# EAGLE design OledAdapter (EAGLE 7.5.0)
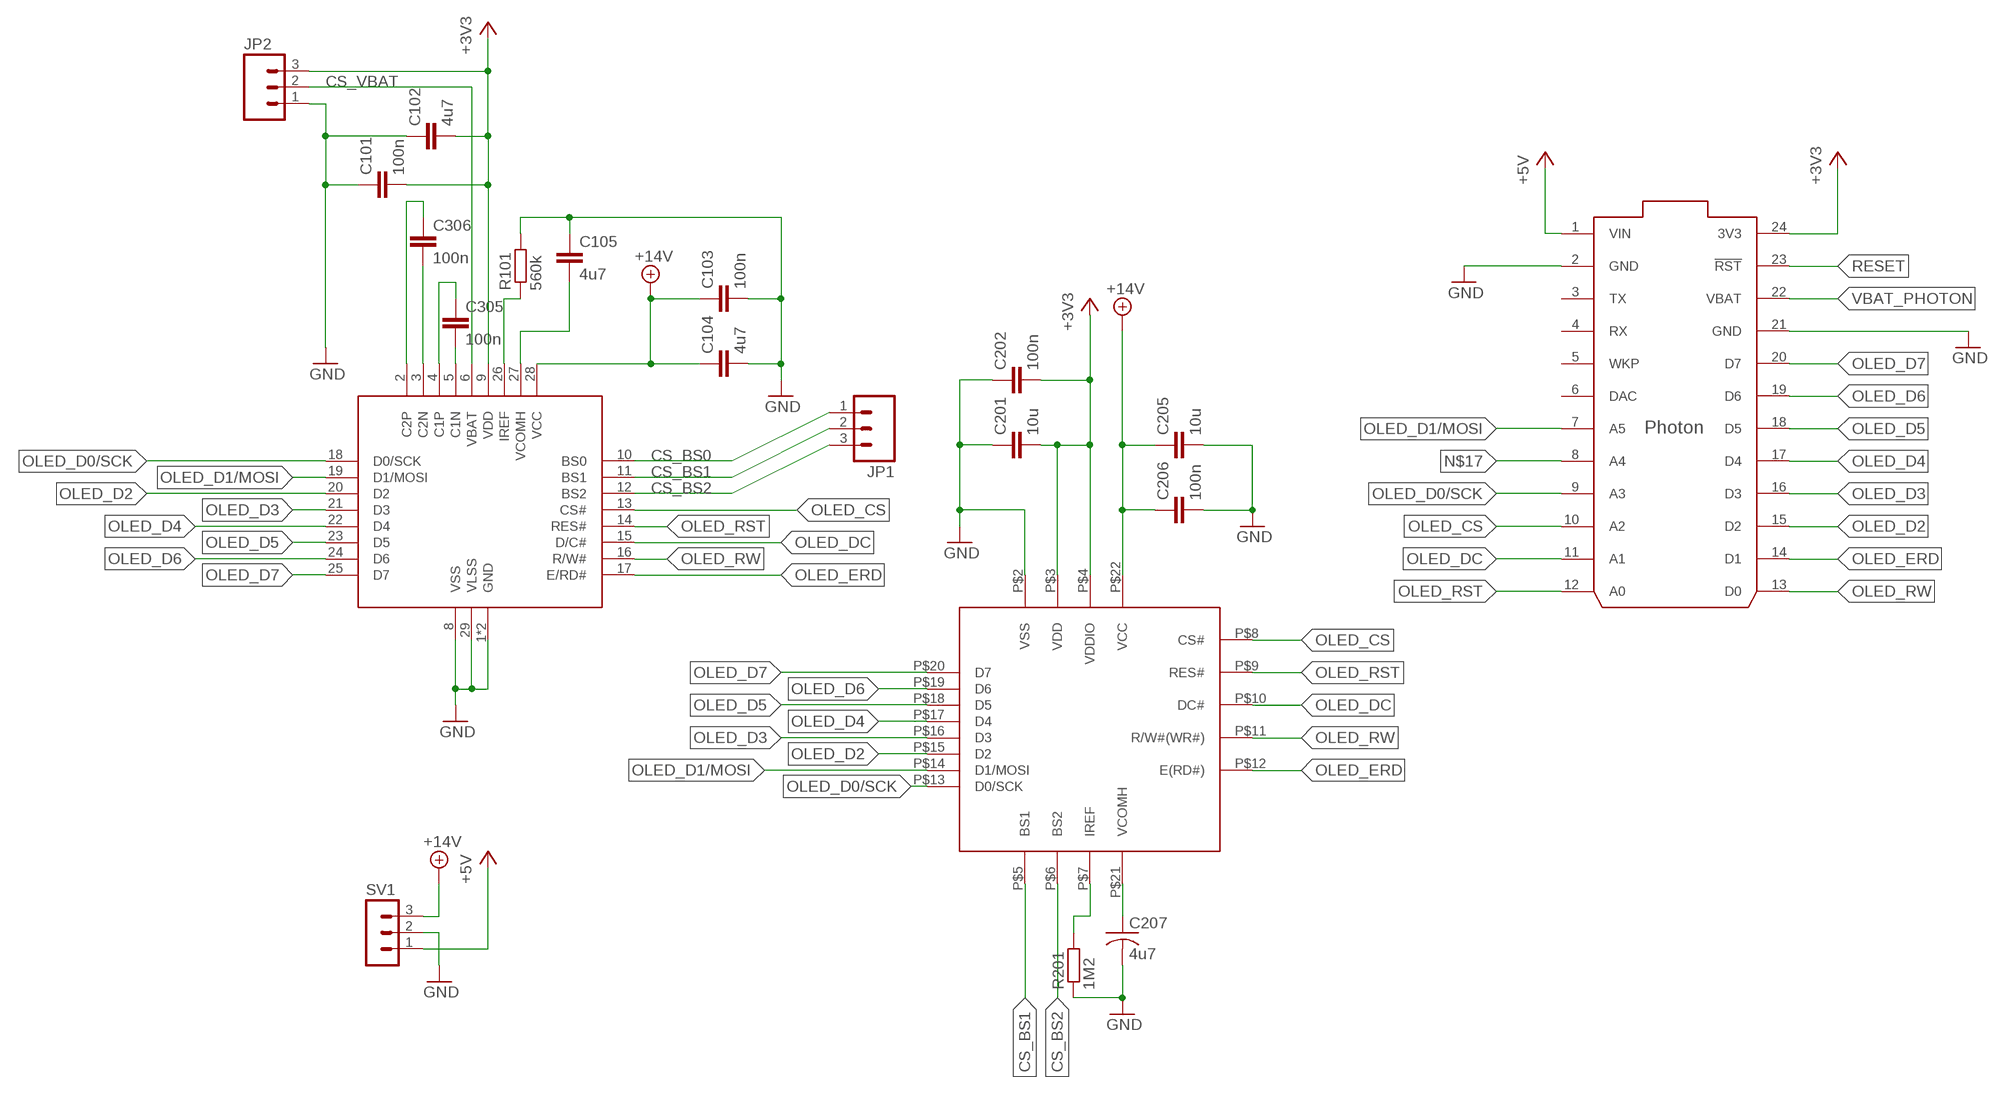
[diagram p0: schematic, sheet 1]

## Parts
C101  100n  C-EUC0603  [C0603]
C102  4u7  C-EUC0603  [C0603]
C103  100n  C-EUC0603  [C0603]
C104  4u7  C-EUC0603  [C0603]
C105  4u7  C-EUC0603  [C0603]
C201  10u  C-EUC0603  [C0603]
C202  100n  C-EUC0603  [C0603]
C205  10u  C-EUC0603  [C0603]
C206  100n  C-EUC0603  [C0603]
C207  4u7  C-USC0603  [C0603]
C305  100n  C-EUC0603  [C0603]
C306  100n  C-EUC0603  [C0603]
JP1  M03PTH  [1X03]
JP2  M03PTH  [1X03]
R101  560k  R-EU_R0603  [R0603]
R201  1M2  R-EU_R0603  [R0603]
SV1  MA03-1  [MA03-1]
U$1  MCOT128064NZ-YM  [MCOT128064NZ-YM]
U$2  PHOTON_WITH_HEADERS  [PHOTON]
U$3  MCOT096064AZ-RGBM  [MCOT096064AZ-RGBM]

## Nets
+3V3: C101.2 C102.2 C201.2 C202.2 JP2.3 U$1.9(VDD) U$2.24(3V3) U$3.P$3(VDD) U$3.P$4(VDDIO)
+5V: SV1.1 U$2.1(VIN)
+14V: C103.1 C104.1 C205.1 C206.1 SV1.3 U$1.28(VCC) U$3.P$22(VCC)
CS_BS0: JP1.1 U$1.10(BS0)
CS_BS1: JP1.2 U$1.11(BS1) U$3.P$5(BS1)
CS_BS2: JP1.3 U$1.12(BS2) U$3.P$6(BS2)
CS_VBAT: JP2.2 U$1.6(VBAT)
GND: C101.1 C102.1 C103.2 C104.2 C105.1 C201.1 C202.1 C205.2 C206.2 C207.2 JP2.1 R101.2 R201.1 SV1.2 U$1.1(GND) U$1.8(VSS) U$1.29(VLSS) U$1.30(GND) U$2.2(GND) U$2.21(GND) U$3.P$2(VSS)
N$2: C305.2 U$1.5(C1N)
N$3: C305.1 U$1.4(C1P)
N$4: C306.2 U$1.3(C2N)
N$5: R101.1 U$1.26(IREF)
N$6: C207.1 U$3.P$21(VCOMH)
N$7: C105.2 U$1.27(VCOMH)
N$8: R201.2 U$3.P$7(IREF)
N$9: C306.1 U$1.2(C2P)
N$17: U$2.8(A4)
OLED_CS: U$1.13(CS#) U$2.10(A2) U$3.P$8(CS#)
OLED_D0/SCK: U$1.18(D0/SCK) U$2.9(A3) U$3.P$13(D0/SCK)
OLED_D1/MOSI: U$1.19(D1/MOSI) U$2.7(A5) U$3.P$14(D1/MOSI)
OLED_D2: U$1.20(D2) U$2.15(D2) U$3.P$15(D2)
OLED_D3: U$1.21(D3) U$2.16(D3) U$3.P$16(D3)
OLED_D4: U$1.22(D4) U$2.17(D4) U$3.P$17(D4)
OLED_D5: U$1.23(D5) U$2.18(D5) U$3.P$18(D5)
OLED_D6: U$1.24(D6) U$2.19(D6) U$3.P$19(D6)
OLED_D7: U$1.25(D7) U$2.20(D7) U$3.P$20(D7)
OLED_DC: U$1.15(D/C#) U$2.11(A1) U$3.P$10(DC#)
OLED_ERD: U$1.17(E/RD#) U$2.14(D1) U$3.P$12(E(RD#))
OLED_RST: U$1.14(RES#) U$2.12(A0) U$3.P$9(RES#)
OLED_RW: U$1.16(R/W#) U$2.13(D0) U$3.P$11(R/W#(WR#))
RESET: U$2.23(!RST)
VBAT_PHOTON: U$2.22(VBAT)
Unconnected: U$2.3(TX) U$2.4(RX) U$2.5(WKP) U$2.6(DAC)

## Library data of the parts
C101-C105 C201 C202 C205 C206 C305 C306 = rcl:C-EU: CAPACITOR, European symbol
C207 = rcl:C-US: CAPACITOR, American symbol
JP1 JP2 = SparkFun-Connectors:M03: Header 3 Standard 3-pin 0.1" header. Use with straight break away headers (SKU : PRT-00116), right angle break away headers (PRT-00553), swiss pins (PRT-00743), machine pins (PRT-00117), and female headers (PRT-00115). Molex polarized connector foot print use with SKU : PRT-08232 with associated crimp pins and housings.
R101 R201 = rcl:R-EU_: RESISTOR, European symbol
SV1 = con-lstb:MA03-1: PIN HEADER; OC_FARNELL: unknown; OC_NEWARK: unknown
U$1 = MCOT128064NZ-YM:MCOT128064NZ-YM
U$2 = smartplug:PHOTON
U$3 = MCOT096064AZ-RGBM:MCOT096064AZ-RGBM: Midas 0.95in Red, Green, Blue Passive matrix OLED Display 96 x 64 TAB Multi Interface

## Board
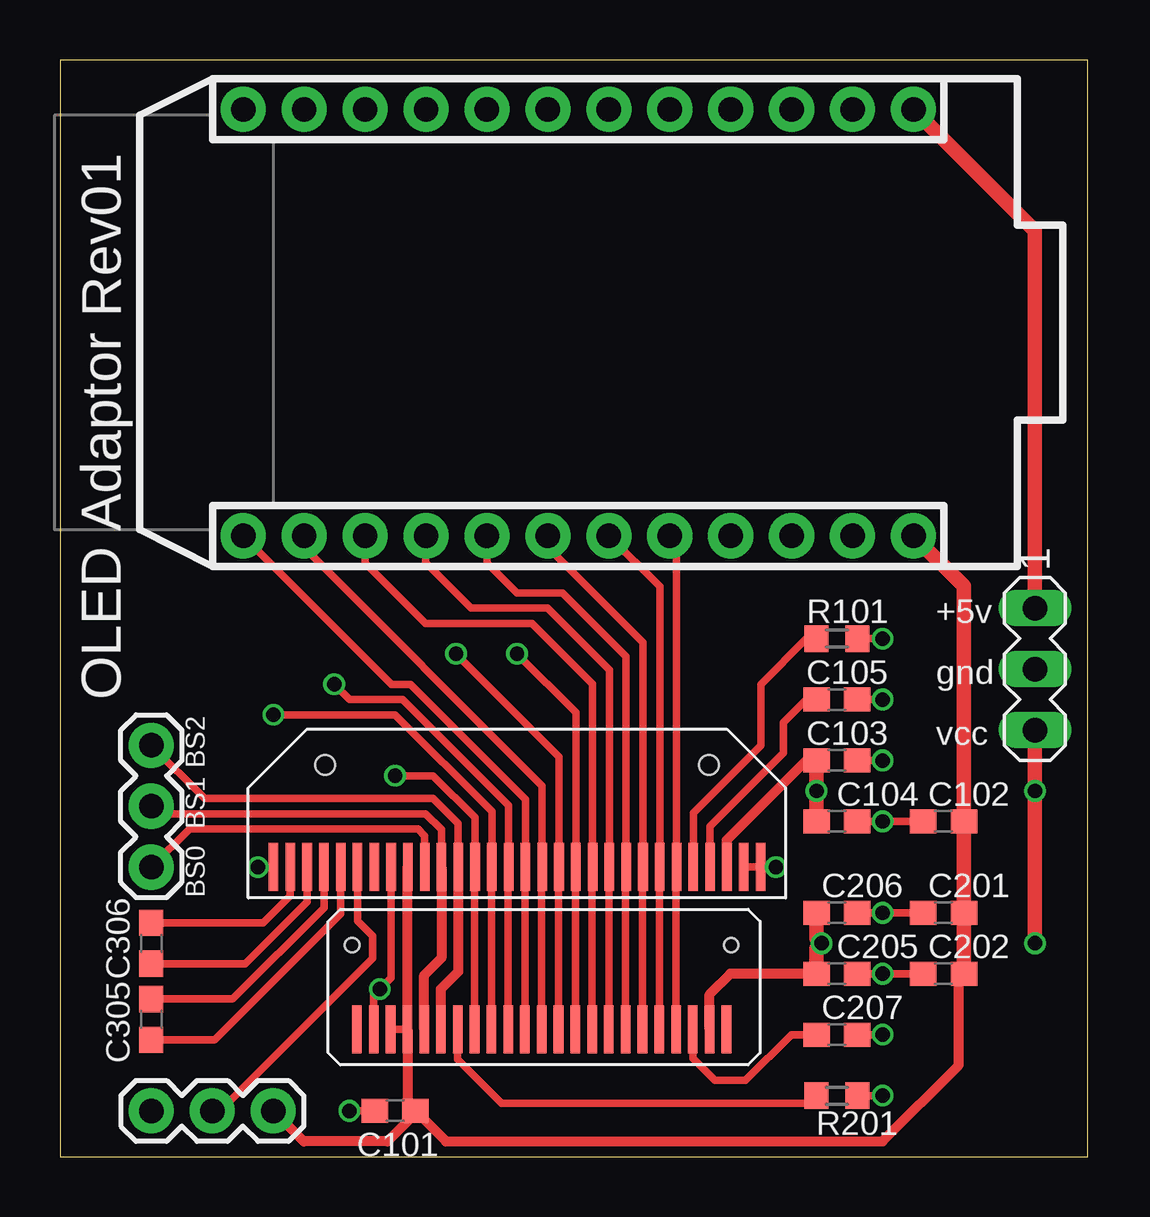
[diagram p1: board, top side]
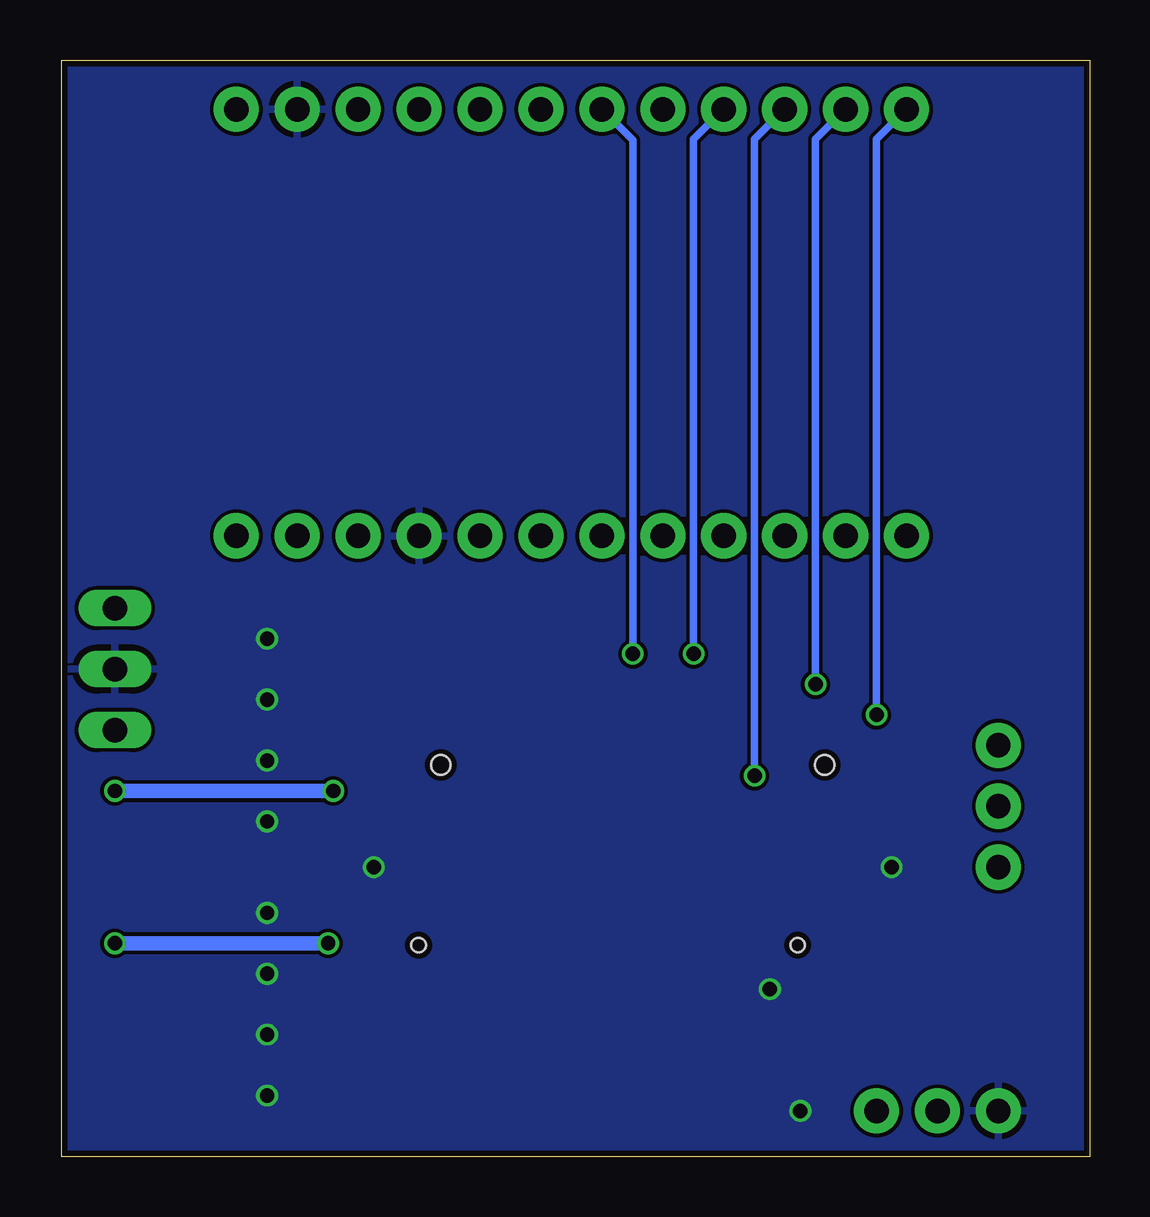
[diagram p2: board, bottom side, seen from below]

Size 42.85 x 45.71 mm. Coordinates in mm from the lower left corner, seen from the top.
Outline: 0,0 42.85,0 42.85,45.71 0,45.71 0,0
Copper layers (1*16): Top 0.035mm / dielectric 1.5mm / Bottom 0.035mm
Design rules "SeeedStudio_2layer_DRU_no_angle_20140221": minimum track width 6mil, minimum drill 12mil, track to track 6mil, track to pad 6mil, pad to pad 6mil, via to via 6mil, smd to smd 0mil, copper to edge 10mil, drill to drill 10mil, minimum pad ring 10mil, minimum via ring 6mil, stop-mask expansion 2mil, vias tented up to drill 100mil, thermal gap 10mil

### Footprints (pad centres in the part's own frame; a part is rotated, then mirrored left to right if it is on the bottom)
C0603 = smd 1.1 x 1: 1 -0.85,0; 2 0.85,0
1X03 = drill 1.016 pad 1.88: 1 0,0; 2 2.54,0; 3 5.08,0
R0603 = smd 1 x 1.1: 1 -0.85,0; 2 0.85,0
MA03-1 = drill 1.016 long: 1 -2.54,0; 2 0,0; 3 2.54,0
MCOT128064NZ-YM = smd 0.4 x 2: 1 -10.15,-2.532; 2 -9.45,-2.532; 3 -8.75,-2.532; 4 -8.05,-2.532; 5 -7.35,-2.532; 6 -6.65,-2.532; 7 -5.95,-2.532; 8 -5.25,-2.532; 9 -4.55,-2.532; 10 -3.85,-2.532; 11 -3.15,-2.532; 12 -2.45,-2.532; 13 -1.75,-2.532; 14 -1.05,-2.532; 15 -0.35,-2.532; 16 0.35,-2.532; 17 1.05,-2.532; 18 1.75,-2.532; 19 2.45,-2.532; 20 3.15,-2.532; 21 3.85,-2.532; 22 4.55,-2.532; 23 5.25,-2.532; 24 5.95,-2.532; 25 6.65,-2.532; 26 7.35,-2.532; 27 8.05,-2.532; 28 8.75,-2.532; 29 9.45,-2.532; 30 10.15,-2.532 | hole 0.8: -8,1.718; 8,1.718
PHOTON = drill 1.016 pad 1.88: 1 -8.73,15.258; 2 -8.73,12.718; 3 -8.73,10.178; 4 -8.73,7.638; 5 -8.73,5.098; 6 -8.73,2.558; 7 -8.73,0.018; 8 -8.73,-2.522; 9 -8.73,-5.062; 10 -8.73,-7.602; 11 -8.73,-10.142; 12 -8.73,-12.682; 13 9.05,-12.682; 14 9.05,-10.142; 15 9.05,-7.602; 16 9.05,-5.062; 17 9.05,-2.522; 18 9.05,0.018; 19 9.05,2.558; 20 9.05,5.098; 21 9.05,7.638; 22 9.05,10.178; 23 9.05,12.718; 24 9.05,15.258
MCOT096064AZ-RGBM = smd 0.4 x 2: P$1 -7.72,-2.024; P$2 -7.02,-2.024; P$3 -6.32,-2.024; P$4 -5.62,-2.024; P$5 -4.92,-2.024; P$6 -4.22,-2.024; P$7 -3.52,-2.024; P$8 -2.82,-2.024; P$9 -2.12,-2.024; P$10 -1.42,-2.024; P$11 -0.72,-2.024; P$12 -0.02,-2.024; P$13 0.68,-2.024; P$14 1.38,-2.024; P$15 2.08,-2.024; P$16 2.78,-2.024; P$17 3.48,-2.024; P$18 4.18,-2.024; P$19 4.88,-2.024; P$20 5.58,-2.024; P$21 6.28,-2.024; P$22 6.98,-2.024; P$23 7.68,-2.024 | hole 0.6: -7.92,1.476; 7.88,1.476

### Placement (x,y rotation side)
C101  13.97,1.91 0 top
C102  36.83,13.97 0 top
C103  32.38,16.51 0 top
C104  32.38,13.97 0 top
C105  32.38,19.05 180 top
C201  36.83,10.16 0 top
C202  36.83,7.62 0 top
C205  32.38,7.62 0 top
C206  32.38,10.16 0 top
C207  32.38,5.08 0 top
C305  3.81,5.71 270 top
C306  3.81,8.89 270 top
JP1  3.81,12.06 90 top
JP2  3.81,1.91 0 top
R101  32.38,21.59 0 top
R201  32.38,2.54 180 top
SV1  40.64,20.32 270 top
U$1  19.05,14.61 0 top
U$2  20.32,34.92 270 top
U$3  20.1,7.33 0 top

### Tracks (layer width: path | path; a pad name or v marks a point on that pad's centre or on a via)
+3V3
  Top 0.305: 14.48,12.05 U$1.9 | 37.47,7.4 C202.2 | U$3.P$3 U$3.P$4
  Top 0.406: 14.48,12.05 U$3.P$4 14.48,2.25 C101.2 | 37.47,7.4 37.47,3.81 34.29,0.64 16.09,0.64 C101.2 | JP2.3 10.16,0.64 13.65,0.64 14.5,1.48 C101.2
  Top 0.61: C202.2 C201.2 C102.2 37.68,23.77 U$2.24
+5V
  Top 0.61: SV1.1 40.64,38.59 U$2.1
+14V  (via drill 0.6)
  Top 0.406: C103.1 31.11,16.51 27.8,13.2 U$1.28 | C205.1 27.94,7.62 27.08,6.76 U$3.P$22
  Top 0.61: SV1.3 v40.64,15.24 v40.64,8.89 | C104.1 v31.54,15.24 C103.1 | C206.1 31.54,9.11 v31.75,8.89 31.54,8.67 C205.1
  Bottom 0.61: v40.64,15.24 v31.54,15.24 | v31.75,8.89 v40.64,8.89
CS_BS0
  Top 0.305: U$1.10 15.2,13.38 14.92,13.65 5.4,13.65 JP1.1
CS_BS1
  Top 0.305: U$1.11 15.9,13.63 15.24,14.29 4.45,14.29 JP1.2
  Top 0.406: U$3.P$5 15.18,7.56 15.9,8.28 U$1.11
CS_BS2
  Top 0.305: U$1.12 16.6,13.88 15.56,14.92 6.03,14.92 JP1.3
  Top 0.406: U$3.P$6 15.88,6.99 16.6,7.71 U$1.12
CS_VBAT
  Top 0.305: U$1.6 12.4,9.82 13.04,9.19 13.04,8.27 6.67,1.91 JP2.2
GND  (via drill 0.6)
  Top 0.305: U$3.P$2 13.08,6.73 v13.34,6.98 13.8,7.45 U$1.8 | U$1.29 U$1.30 v29.84,12.07 v29.84,12.06 | R201.1 v34.29,2.54 | R101.2 v34.29,21.59 | C105.1 v34.29,19.05 | C103.2 v34.29,16.51 | C104.2 v34.29,13.97 C102.1 | C206.2 v34.29,10.16 C201.1 | C205.2 v34.29,7.62 C202.1 | C207.2 v34.29,5.08 | U$1.1 v8.26,12.07 v8.26,12.06 | C101.1 v12.06,1.91
  pour Bottom: -1.91,48.26 48.26,48.26 48.26,-1.27 -1.91,-1.27
N$2
  Top 0.305: U$1.5 11.7,10.11 6.45,4.87 C305.2
N$3
  Top 0.305: C305.1 7.2,6.56 11,10.37 U$1.4
N$4
  Top 0.305: C306.2 7.72,8.04 10.3,10.62 U$1.3
N$5
  Top 0.305: U$1.26 26.4,14.33 29.21,17.15 29.21,19.69 31.11,21.59 R101.1
N$6
  Top 0.305: C207.1 30.48,5.08 28.57,3.17 27.3,3.17 26.38,4.1 U$3.P$21
N$7
  Top 0.305: U$1.27 27.1,13.77 30.16,16.83 30.16,18.1 31.11,19.05 C105.2
N$8
  Top 0.305: U$3.P$7 16.58,4.06 18.41,2.22 31.22,2.22 R201.2
N$9
  Top 0.305: C306.1 8.47,9.74 9.6,10.87 U$1.2
OLED_CS  (via drill 0.6)
  Top 0.305: U$3.P$8 17.28,12.05 U$1.13 17.3,14.13 15.56,15.88 v13.97,15.88
  Bottom 0.305: v13.97,15.88 13.97,42.4 U$2.10
OLED_D0/SCK  (via drill 0.6)
  Top 0.305: U$3.P$13 20.78,12.05 U$1.18 20.8,16.67 v16.51,20.96
  Bottom 0.305: v16.51,20.96 16.51,42.4 U$2.9
OLED_D1/MOSI  (via drill 0.6)
  Top 0.305: U$3.P$14 21.48,12.05 U$1.19 21.5,18.51 v19.05,20.96
  Bottom 0.305: v19.05,20.96 19.05,42.37 U$2.7
OLED_D2
  Top 0.305: U$3.P$15 22.18,12.05 U$1.20 22.2,19.71 19.68,22.23 15.24,22.23 12.72,24.75 U$2.15
OLED_D3
  Top 0.305: U$3.P$16 22.88,12.05 U$1.21 22.9,20.28 20.32,22.86 17.14,22.86 15.24,24.77 15.24,25.86 U$2.16
OLED_D4
  Top 0.305: U$3.P$17 23.58,12.05 U$1.22 23.6,20.85 20.95,23.5 19.05,23.5 17.8,24.75 U$2.17
OLED_D5
  Top 0.305: U$3.P$18 24.28,12.05 U$1.23 24.3,21.42 20.34,25.38 U$2.18
OLED_D6
  Top 0.305: U$3.P$19 24.98,12.05 U$1.24 25,23.75 U$2.19
OLED_D7
  Top 0.305: U$3.P$20 25.68,12.05 U$1.25 25.7,25.59 U$2.20
OLED_DC  (via drill 0.6)
  Top 0.305: U$3.P$10 18.68,12.05 U$1.15 18.7,14.64 14.29,19.05 12.06,19.05 v11.43,19.69
  Bottom 0.305: v11.43,19.69 11.43,42.4 U$2.11
OLED_ERD
  Top 0.305: U$3.P$12 20.08,12.05 U$1.17 20.1,15.46 10.16,25.4 10.16,25.86 U$2.14
OLED_RST  (via drill 0.6)
  Top 0.305: U$3.P$9 17.98,12.05 U$1.14 18,14.38 13.97,18.42 v8.89,18.42
  Bottom 0.305: v8.89,18.42 8.89,42.4 U$2.12
OLED_RW
  Top 0.305: U$3.P$11 19.38,12.05 U$1.16 19.4,14.89 14.61,19.69 13.83,19.69 U$2.13 7.62,25.86

### Text on the board
tPlace: +5v | gnd | OLED Adaptor Rev01 | vcc | BS2 | BS1 | BS0